# Altium schematic sheet ESP32.SchDoc
size B
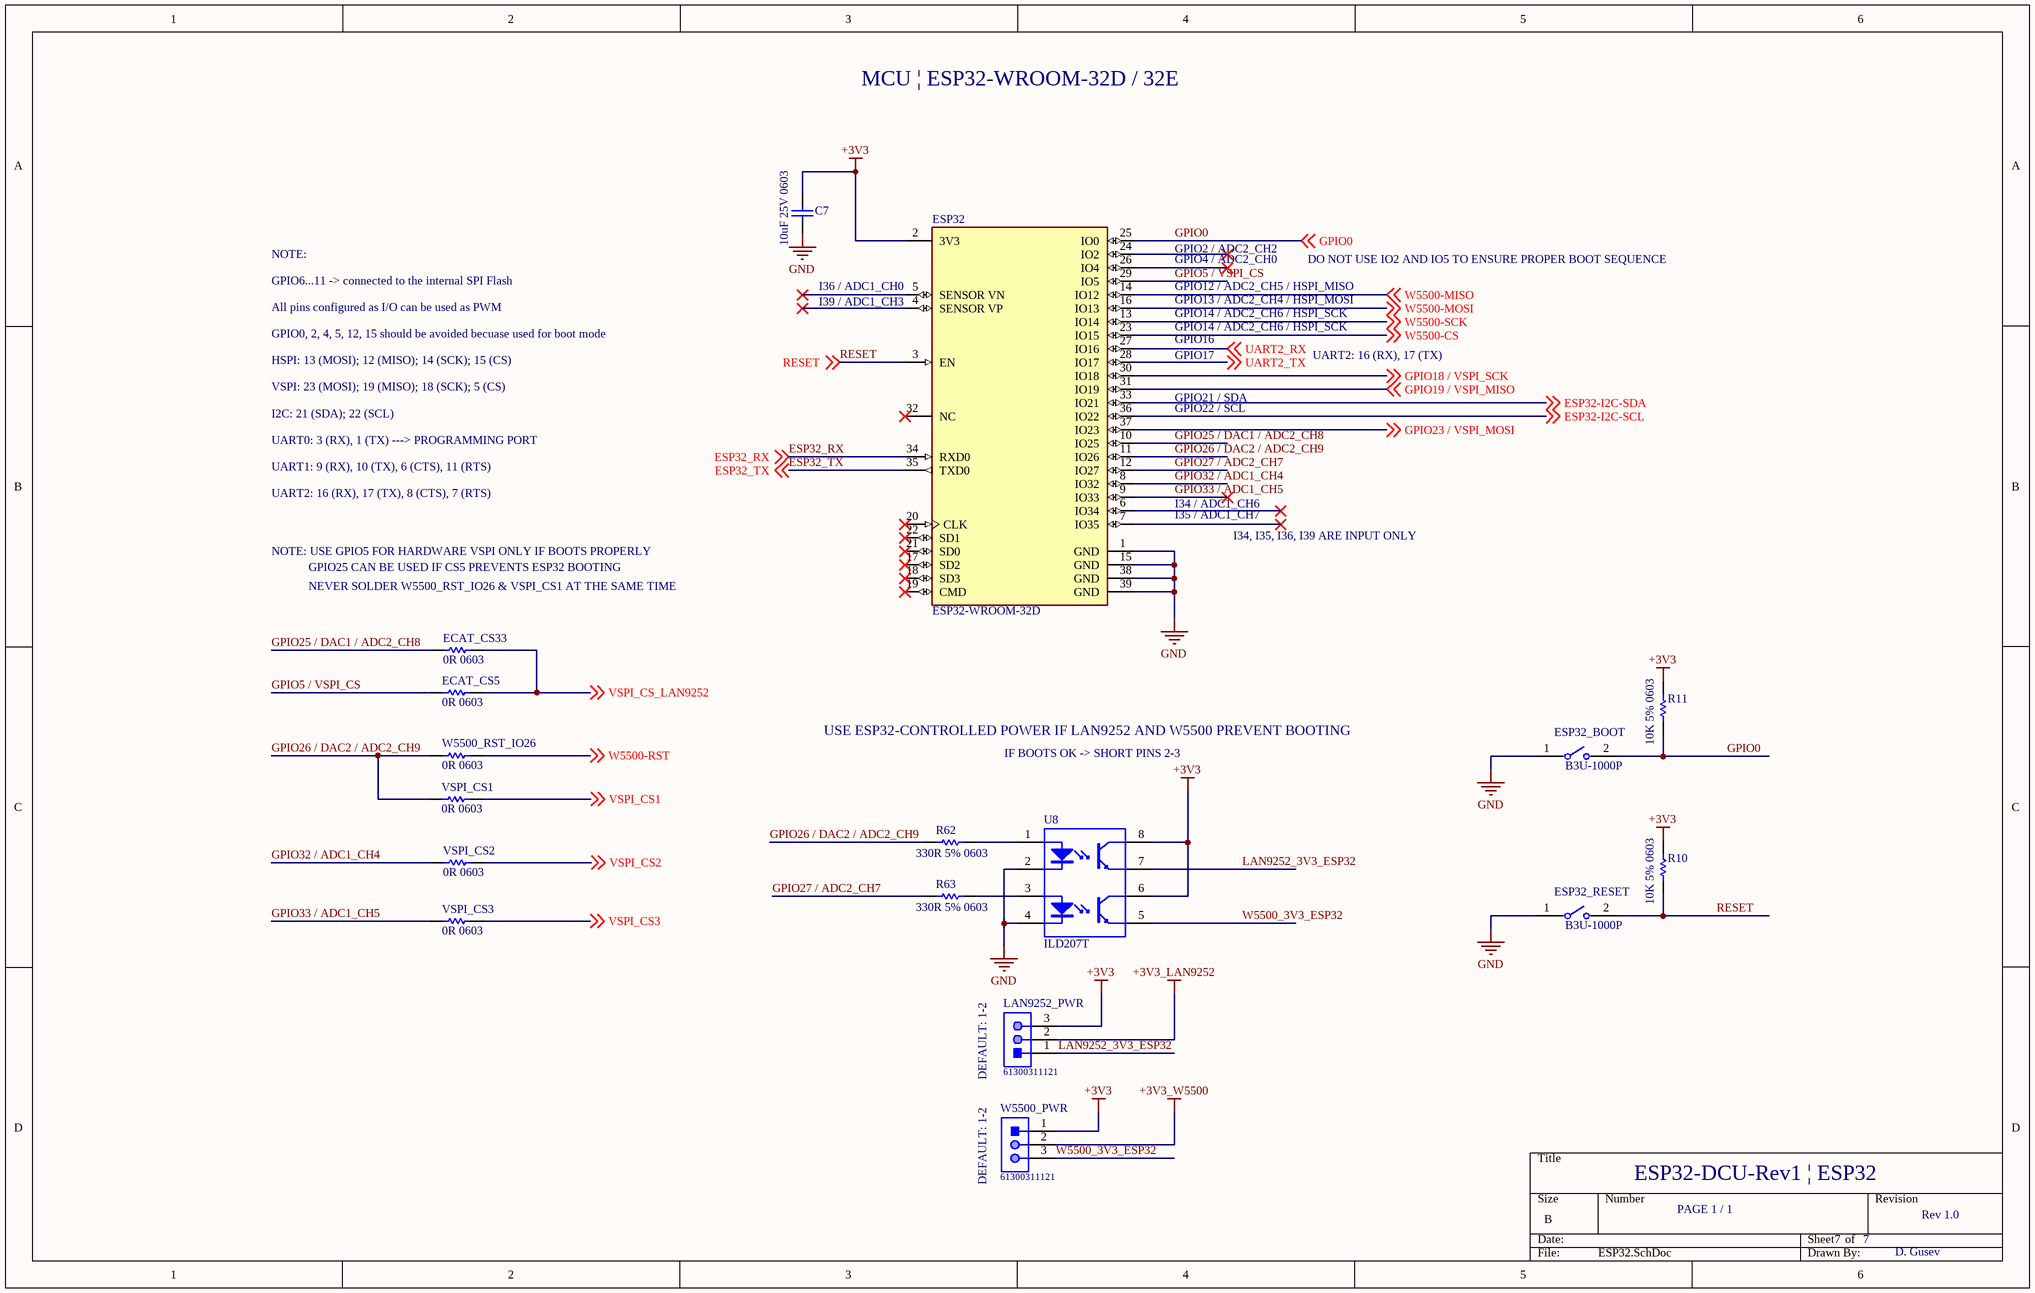
[diagram p0: ESP32.SchDoc]

## Parts
C7  10uF 25V 0603  [CAPC1608X100X20VL10T10]
ECAT_CS5  0R 0603  [RESC1608X55X25ML10T15]
ECAT_CS33  0R 0603  [RESC1608X55X25ML10T15]
ESP32  ESP32-WROOM-32D  [FP-ESP32-WROOM-32D-MFG]
ESP32_BOOT  B3U-1000P  [FP-B3U-1000P-MFG]
ESP32_RESET  B3U-1000P  [FP-B3U-1000P-MFG]
LAN9252_PWR  61300311121  [61300311121]
R10  10K 5% 0603  [RESC1608X55X25ML10T15]
R11  10K 5% 0603  [RESC1608X55X25ML10T15]
R62  330R 5% 0603  [RESC1608X55X25NL10T15]
R63  330R 5% 0603  [RESC1608X55X25NL10T15]
U8  ILD207T  [VISH-SOIC-8_C_V]
VSPI_CS1  0R 0603  [RESC1608X55X25ML10T15]
VSPI_CS2  0R 0603  [RESC1608X55X25ML10T15]
VSPI_CS3  0R 0603  [RESC1608X55X25ML10T15]
W5500_PWR  61300311121  [61300311121]
W5500_RST_IO26  0R 0603  [RESC1608X55X25ML10T15]

## Nets
+3V3: C7.2 ESP32.2(3V3) LAN9252_PWR.3 R10.2 R11.2 U8.6(C) U8.8(C) W5500_PWR.1
+3V3_LAN9252: LAN9252_PWR.2
+3V3_W5500: W5500_PWR.2
GND: C7.1 ESP32.1(GND) ESP32.15(GND) ESP32.38(GND) ESP32.39(GND) ESP32_BOOT.1 ESP32_RESET.1 U8.2(K) U8.4(K)
ESP32-I2C-SCL: ESP32.36(IO22) ; off-sheet ESP32-I2C-SCL
ESP32-I2C-SDA: ESP32.33(IO21) ; off-sheet ESP32-I2C-SDA
ESP32_RX: ESP32.34(RXD0) ; off-sheet ESP32_RX
ESP32_TX: ESP32.35(TXD0) ; off-sheet ESP32_TX
GPIO0: ESP32.25(IO0) ESP32_BOOT.2 R11.1 ; off-sheet GPIO0
GPIO5 / VSPI_CS: ECAT_CS5.1 ESP32.29(IO5)
GPIO18 / VSPI_SCK: ESP32.30(IO18) ; off-sheet GPIO18 / VSPI_SCK
GPIO19 / VSPI_MISO: ESP32.31(IO19) ; off-sheet GPIO19 / VSPI_MISO
GPIO23 / VSPI_MOSI: ESP32.37(IO23) ; off-sheet GPIO23 / VSPI_MOSI
GPIO25 / DAC1 / ADC2_CH8: ECAT_CS33.1 ESP32.10(IO25)
GPIO26 / DAC2 / ADC2_CH9: ESP32.11(IO26) R62.1 VSPI_CS1.1 W5500_RST_IO26.1
GPIO27 / ADC2_CH7: ESP32.12(IO27) R63.1
GPIO32 / ADC1_CH4: ESP32.8(IO32) VSPI_CS2.1
GPIO33 / ADC1_CH5: ESP32.9(IO33) VSPI_CS3.1
LAN9252_3V3_ESP32: LAN9252_PWR.1 U8.7(E)
RESET: ESP32.3(EN) ESP32_RESET.2 R10.1 ; off-sheet RESET
UART2_RX: ESP32.27(IO16) ; off-sheet UART2_RX
UART2_TX: ESP32.28(IO17) ; off-sheet UART2_TX
VSPI_CS1: VSPI_CS1.2 ; off-sheet VSPI_CS1
VSPI_CS2: VSPI_CS2.2 ; off-sheet VSPI_CS2
VSPI_CS3: VSPI_CS3.2 ; off-sheet VSPI_CS3
VSPI_CS_LAN9252: ECAT_CS5.2 ECAT_CS33.2 ; off-sheet VSPI_CS_LAN9252
W5500-CS: ESP32.23(IO15) ; off-sheet W5500-CS
W5500-MISO: ESP32.14(IO12) ; off-sheet W5500-MISO
W5500-MOSI: ESP32.16(IO13) ; off-sheet W5500-MOSI
W5500-RST: W5500_RST_IO26.2 ; off-sheet W5500-RST
W5500-SCK: ESP32.13(IO14) ; off-sheet W5500-SCK
W5500_3V3_ESP32: U8.5(E) W5500_PWR.3
NetR62_2: R62.2 U8.1(A)
NetR63_2: R63.2 U8.3(A)

Not connected (* = marked no-connect by the designer): ESP32 4(SENSOR_VP)* 5(SENSOR_VN)* 6(IO34)* 7(IO35)* 17(SD2)* 18(SD3)* 19(CMD)* 20(CLK)* 21(SD0)* 22(SD1)* 24(IO2)* 26(IO4)* 32(NC)*

## Notes on the sheet
- MCU | ESP32-WROOM-32D / 32E
- NOTE:
- GPIO6...11 -> connected to the internal SPI Flash
- (near ESP32) I36 / ADC1_CH0
- GPIO13 / ADC2_CH4 / HSPI_MOSI
- GPIO2 / ADC2_CH2
- GPIO4 / ADC2_CH0
- GPIO12 / ADC2_CH5 / HSPI_MISO
- DO NOT USE IO2 AND IO5 TO ENSURE PROPER BOOT SEQUENCE
- All pins configured as I/O can be used as PWM
- GPIO0, 2, 4, 5, 12, 15 should be avoided becuase used for boot mode
- HSPI: 13 (MOSI); 12 (MISO); 14 (SCK); 15 (CS)
- (near ESP32) I39 / ADC1_CH3
- GPIO14 / ADC2_CH6 / HSPI_SCK
- GPIO16
- GPIO17
- UART2: 16 (RX), 17 (TX)
- VSPI: 23 (MOSI); 19 (MISO); 18 (SCK); 5 (CS)
- I2C: 21 (SDA); 22 (SCL)
- GPIO21 / SDA
- GPIO22 / SCL
- UART0: 3 (RX), 1 (TX) ---> PROGRAMMING PORT
- UART1: 9 (RX), 10 (TX), 6 (CTS), 11 (RTS)
- UART2: 16 (RX), 17 (TX), 8 (CTS), 7 (RTS)
- NOTE: USE GPIO5 FOR HARDWARE VSPI ONLY IF BOOTS PROPERLY
- GPIO25 CAN BE USED IF CS5 PREVENTS ESP32 BOOTING
- I34 / ADC1_CH6
- I35 / ADC1_CH7
- I34, I35, I36, I39 ARE INPUT ONLY
- NEVER SOLDER W5500_RST_IO26 & VSPI_CS1 AT THE SAME TIME
- USE ESP32-CONTROLLED POWER IF LAN9252 AND W5500 PREVENT BOOTING
- IF BOOTS OK -> SHORT PINS 2-3
- DEFAULT: 1-2
- (near W5500_PWR) DEFAULT: 1-2
- ESP32-DCU-Rev1 | ESP32
- PAGE 1 / 1
- 7
- Rev 1.0
- D. Gusev

## Library data of the parts
C7 = CMP-2000-05442-1: Chip Capacitor, 10 uF, +/- 20%, 25 V, -55 to 85 degC, 0603 (1608 Metric), RoHS, Tape and Reel; Manufacturer: TDK; PCN Part Number: MLCCPartNumberChange30/Nov/2012; Other Names: 445-9015-1; Capacitance: 10µF; Design Resources: 20WNon-IsolatedBuckLEDDriverUsingPLLNK460KG; Kits: 445-9014-KIT-ND-KITMLCC100PF-22UF060310-50V; Product Training Modules: SEAT,CCV,andTVCLDesignToolsGuidetoReplacinganElectrolyticCapacitorwithanMLCC; Online Catalog: CSeries,GeneralPurpose; Temperature Coefficient: X5R; Package Description: 2-Pin Surface Mount Device, Body 1.6 x 0.8 mm; Lead Style: -; Datasheet URL: http://download.siliconexpert.com/pdfs/2016/2/22/9/40/35/949/tdk_/manual/8010476609961980104703407078c1608x5r1e106m080ac.pdf.pdf; Category: Capacitors; Package / Case: 0603(1608Metric); Packaging: CutTape(CT); Series: C; Features: -; Family: CeramicCapacitors; Standard Package: 1; Tolerance: ±20%; Operating Temperature: -55degC~85degC; Mounting Type: SurfaceMount,MLCC; Ratings: -; Size / Dimension: 0.063"Lx0.031"W(1.60mmx0.80mm); Applications: GeneralPurpose; Package Reference: 1608; RoHS Information: RoHSCertificate-MLCC; Manufacturer URL: http://www.tdk.com/; Datasheet Version: Feb-16; Voltage - Rated: 25V; Height - Seated (Max): -; Thickness (Max): 0.039"(1.00mm); Lead Spacing: -
ECAT_CS5 ECAT_CS33 VSPI_CS1-VSPI_CS3 W5500_RST_IO26 = CMP-2100-03667-1: Chip Resistor, 0 Ohm, +/- 5%, 0.1 W, -55 to 155 degC, 0603 (1608 Metric), RoHS, Tape and Reel; Manufacturer: Yageo; Temperature Coefficient: 200ppm/degreesC; Voltage Rating: 50V; Power Rating: 100mW; Resistance: 0mOhm; Width: 0.8mm; Max Operating Temperature: 155degC; Tolerance: 5%; Package Reference: 0603; Height: 0.45mm; Depth: 0.8mm; Package Description: 2-Pin Surface Mount Device, Body 1.6 x 0.8 mm; Termination: SMD/SMT; Package Quantity: 5000; Case/Package: 0603; Case Code (Imperial): 0603; Radiation Hardening: No; Number of Pins: 2; Length: 1.6mm; Lead Free: LeadFree; Voltage Rating (DC): 50V; Military Standard: Not; Datasheet URL: http://www.yageo.com/NewPortal/yageodocoutput?fileName=/pdf/R-Chip/PYu-RC_Group_51_RoHS_L_5.pdf; Manufacturer URL: http://www.yageo.com/; Packaging: TapeandReel; Case Code (Metric): 1608; Min Operating Temperature: -55degC; Composition: ThickFilm; RoHSCompliant: true; Contact Plating: Tin; Datasheet Version: Rev. 5, 10/2016; REACH SVHC: NoSVHC
ESP32 = CMP-194065-000003-1: WIFI MODULE 32MBITS SPI FLASH; Manufacturer: Espressif Systems; Max Supply Voltage: 3.6V; Nominal Supply Current: 500mA; Max Frequency: 2484MHz; Number Of Adc Channels: 16; Number Of Gpio: 32; Interface: I2C,SPI,UART,Ethernet,I2S,Other; Data Rate: 150Mbits/s; Min Supply Voltage: 3V; Bandwidth: 72MHz; Sensitivity: -98dBm; Octopart: https://octopart.com/esp32-wroom-32d-espressif+systems-91040050; Package: ESP32-WROOM-32D; ComponentLink2URL: https://www.espressif.com/sites/default/files/documentation/esp32-wroom-32d_esp32-wroom-32u_datasheet_en.pdf; Lead Free: Yes; Category: UNK; Mouser Description: Wi-Fi/BT BLE Module ESP32-D0WD, SPI Flash, UART, P; Device Class L1: Integrated Circuits (ICs); RoHS: TRUE; Temperature Range Low: -40°C; ComponentLink2Description: Datasheet; Digikey Description: WIFI MODULE 32MBITS SPI FLASH; Height: 3.2mm; Temperature: -40°C to +85°C; Manufacturer Part Number: ESP32-WROOM-32D; Device Class L3: Transceivers; Device Class L2: RF Semiconductors and Devices; Temperature Range High: +85°C; Automotive: No
ESP32_BOOT ESP32_RESET = CMP-2100-03586-2: SWITCH TACTILE SPST-NO 0.05A 12V; Contact Resistance: 100mR; Operating Force: 1.5N; Max Current Rating: 50mA; Switch Travel: 0.15mm; Actuator Type: Standard; Mechanical Life: 200000Cycles; Ratings: Dust Proof; Illumination Type: Non-Illuminated; Throw Configuration: SPST; Actuator Length: 0.4mm; Switch Function: Off-Mom; Height: 1.2mm; Width: 3mm; Weight: 0.000776oz; Contact Material: Silver; Max Voltage Rating (DC): 12V; Insulation Resistance: 100MR; Lead Free: Lead Free; Current Rating: 50mA; Termination: SMD/SMT; Length: 4mm; Voltage Rating (DC): 12V; Contact Current Rating: 50mA; Orientation: Straight; Depth: 2.5mm; Max Operating Temperature: 70°C; Packaging: Tape and Reel; Min Operating Temperature: -25°C; Package Quantity: 1; Mount: Surface Mount; Electrical Life: 200000Cycles
LAN9252_PWR W5500_PWR = CMP-1502-01062-1: THT Vertical Pin Header WR-PHD, Pitch 2.54 mm, Single Row, 3 pins; Manufacturer: Wurth Elektronik; Withstanding Voltage: 500VAC; Working Voltage: 250VAC; Rated Current: 3A; Pitch: 2.54mm; Pin Number: 3; Gender: Male; Contact Resistance: 20mOhm; Package Reference: 61300311121; Manufacturer URL: http://www.we-online.de; Datasheet URL: https://katalog.we-online.de/em/datasheet/6130xx11121.pdf; Operating Temperature: -40to105degC; Part Number: 61300311121; Orientation: Vertical; Packaging: Bag; Row Number: Single; Mounting Technology: THT; Publisher: WurthElektronik
R10 R11 = CMP-2100-03664-1: Chip Resistor, 10 KOhm, +/- 1%, 01 W, -55 to 155 degC, 0603 (1608 Metric), RoHS, Tape and Reel; Manufacturer: Yageo; Temperature Coefficient: 100ppm/degreesC; Resistance: 10KOhm; Voltage Rating: 75V; Power Rating: 100mW; Voltage Rating (DC): 50V; Composition: ThickFilm; RoHSCompliant: true; Height: 0.45mm; Lead Free: LeadFree; Case Code (Metric): 1608; Case/Package: 0603; Datasheet Version: Rev. 5, 10/2016; Package Reference: 0603; Depth: 0.8mm; Package Description: 2-Pin Surface Mount Device, Body 1.6 x 0.8 mm; Case Code (Imperial): 0603; Packaging: TapeandReel; Termination: SMD/SMT; Lead Pitch: 0.3mm; Width: 0.8mm; Number of Pins: 2; Length: 1.6mm; REACH SVHC: NoSVHC; Military Standard: Not; Max Operating Temperature: 155degC; Min Operating Temperature: -55degC; Manufacturer URL: http://www.yageo.com/; Datasheet URL: http://www.yageo.com/NewPortal/yageodocoutput?fileName=/pdf/R-Chip/PYu-RC_Group_51_RoHS_L_5.pdf; Weight: 7.1E-05oz; Tolerance: 1%
R62 R63 = CMP-1659-00020-2: Chip Resistor, 330 Ohm, +/- 1%, 0.1 W, -55 to 155 degC, 0603 (1608 Metric), RoHS, Tape and Reel; Tolerance: 10%; ESR: 800 mohm; Voltage Rating (DC): 16 V; Capacitance: 47 uF; Length: 7.3 mm; ComponentLink1URL: http://www.yageo.com/; Packaging: Tape and Reel; Pins: 2; ComponentLink1Description: Manufacturer URL; Case Code (Imperial): 2917; REACH SVHC: No SVHC; Width: 4.3 mm; ComponentLink2Description: Datasheet; Voltage Rating: 16 V; RoHSCompliant: True; Max Operating Temperature: 125degC; ComponentLink2URL: http://www.yageo.com/documents/recent/PYu-RC_Group_51_RoHS_L_04.pdf; Min Operating Temperature: -55degC; Case/Package: 2917; Radiation Hardening: No; DatasheetVersion: Rev. 4, 02/2016; Mount: Surface Mount; PackageReference: 0603; Package Quantity: 500; Case Code (Metric): 7343; PackageDescription: 2-Pin Surface Mount Device, Body 1.6 x 0.8 mm; Height: 3.1 mm
U8 = CMP-2000-06453-1: Optocoupler, Phototransistor Output, Dual Channel, 4000 VRMS, -55 to 100 degC, 8-Pin SOIC, RoHS, Tape and Reel; Manufacturer: Vishay; Voltage - Output (Max): 70V; Vce Saturation (Max): 400mV; Number of Channels: 2; Voltage - Forward (Vf) (Typ): 1.2V; EDA / CAD Models: DownloadfromAcceleratedDesigns; Current Transfer Ratio (Min): 100%@10mA; Current Transfer Ratio (Max): 200%@10mA; Input Type: DC; Current - DC Forward (If) (Max): 30mA; Rise / Fall Time (Typ): 3µs,4.7µs; Turn On / Turn Off Time (Typ): 6µs,5µs; Catalog Drawings: OptocouplerCircuit; Other Names: 751-1310-1ILD207TGICTILD207TGICT-ND; Online Catalog: ILD205T,206T,207T,211T,213T,217TSeries; Mounting Type: SurfaceMount; Package Description: 8-Pin Small Outline Integrated Circuit, Body 5.84 x 3.91 mm, Pitch 1.27 mm; Output Type: Transistor; Package / Case: 8-SOIC(0.154",3.90mmWidth); Category: Isolators; Operating Temperature: -55°C~100°C; Family: Optoisolators-Transistor,PhotovoltaicOutput; Package Reference: SOIC-8; Voltage - Isolation: 4000Vrms; Supplier Device Package: 8-SOIC; Standard Package: 1; Manufacturer URL: http://www.vishay.com/; Series: -; Packaging: CutTape(CT); Datasheet Version: Rev. 2.1, 10/2015; Datasheet URL: http://www.vishay.com/docs/83647/ild205t.pdf; Mounting Technology: SurfaceMount; Current - Output / Channel: -